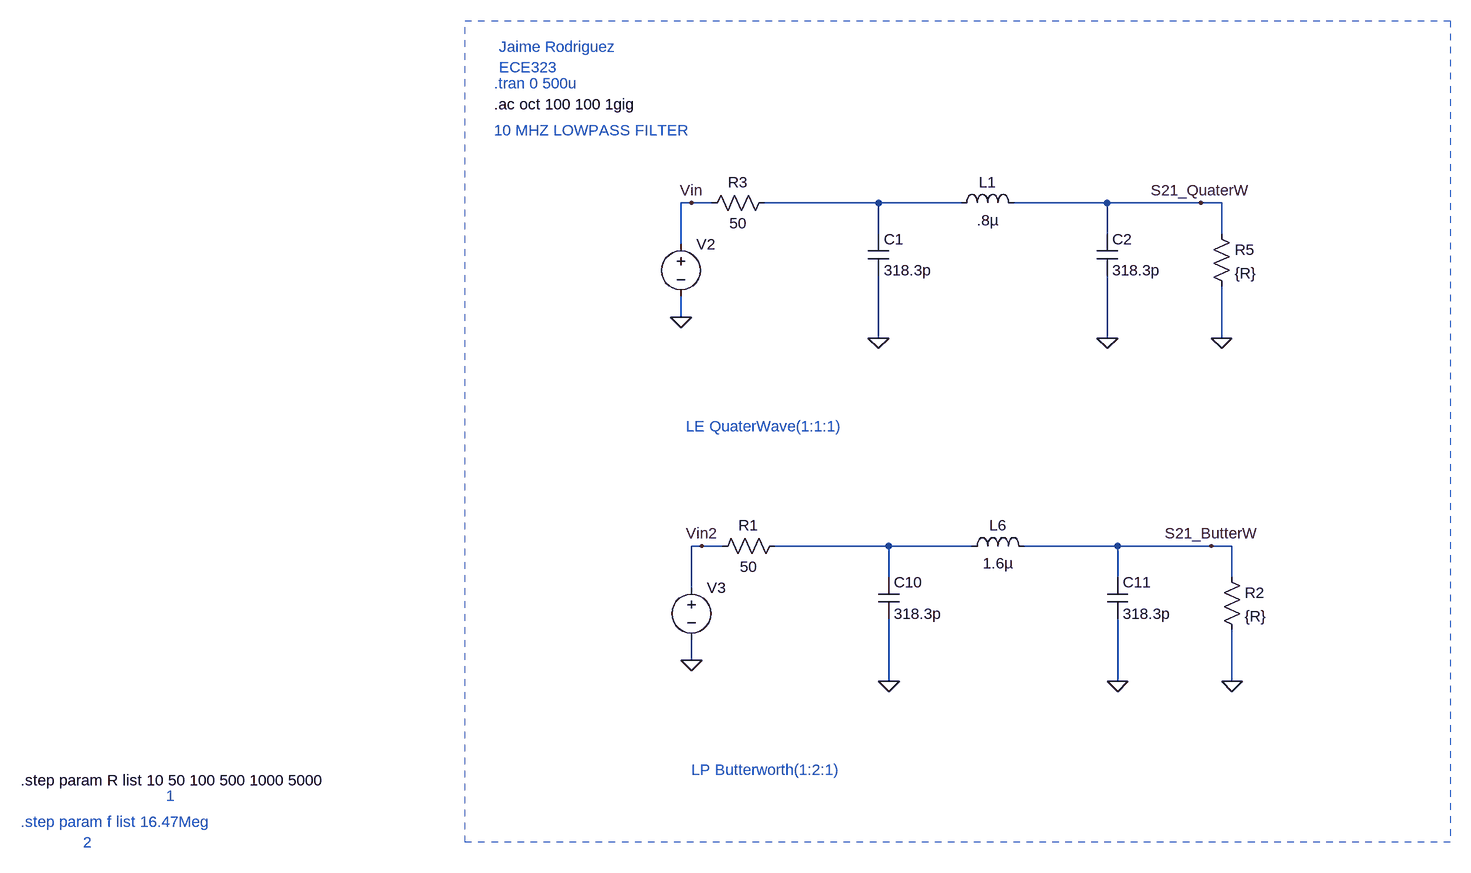
[diagram p0: schematic Lowpass.asc]
Lowpass.asc, the LTspice schematic file:
Version 4
SHEET 1 1652 704
WIRE 480 -1072 464 -1072
WIRE 512 -1072 480 -1072
WIRE 768 -1072 592 -1072
WIRE 896 -1072 768 -1072
WIRE 1120 -1072 976 -1072
WIRE 1264 -1072 1120 -1072
WIRE 1296 -1072 1264 -1072
WIRE 768 -1024 768 -1072
WIRE 1120 -1024 1120 -1072
WIRE 1296 -1024 1296 -1072
WIRE 464 -1008 464 -1072
WIRE 464 -896 464 -928
WIRE 768 -864 768 -960
WIRE 1120 -864 1120 -960
WIRE 1296 -864 1296 -944
WIRE 496 -544 480 -544
WIRE 528 -544 496 -544
WIRE 784 -544 608 -544
WIRE 912 -544 784 -544
WIRE 1136 -544 992 -544
WIRE 1280 -544 1136 -544
WIRE 1312 -544 1280 -544
WIRE 784 -496 784 -544
WIRE 1136 -496 1136 -544
WIRE 1312 -496 1312 -544
WIRE 480 -480 480 -544
WIRE 480 -368 480 -400
WIRE 784 -336 784 -432
WIRE 1136 -336 1136 -432
WIRE 1312 -336 1312 -416
FLAG 784 -336 0
FLAG 1136 -336 0
FLAG 480 -368 0
FLAG 1312 -336 0
FLAG 768 -864 0
FLAG 1120 -864 0
FLAG 464 -896 0
FLAG 1296 -864 0
FLAG 1264 -1072 S21_QuaterW
FLAG 1280 -544 S21_ButterW
FLAG 480 -1072 Vin
FLAG 496 -544 Vin2
SYMBOL cap 768 -496 R0
SYMATTR InstName C10
SYMATTR Value 318.3p
SYMBOL cap 1120 -496 R0
SYMATTR InstName C11
SYMATTR Value 318.3p
SYMBOL ind 896 -528 R270
WINDOW 0 32 56 VTop 2
WINDOW 3 5 56 VBottom 2
SYMATTR InstName L6
SYMATTR Value 1.6µ
SYMBOL voltage 480 -496 R0
WINDOW 3 24 96 Invisible 2
WINDOW 39 0 0 Left 2
SYMATTR Value SINE(0 1 6.8Meg)
SYMATTR InstName V3
SYMATTR Value2 AC 2
SYMBOL res 624 -560 R90
WINDOW 0 0 56 VBottom 2
WINDOW 3 32 56 VTop 2
SYMATTR InstName R1
SYMATTR Value 50
SYMBOL res 1296 -512 R0
SYMATTR InstName R2
SYMATTR Value {R}
SYMBOL cap 752 -1024 R0
SYMATTR InstName C1
SYMATTR Value 318.3p
SYMBOL cap 1104 -1024 R0
SYMATTR InstName C2
SYMATTR Value 318.3p
SYMBOL ind 880 -1056 R270
WINDOW 0 32 56 VTop 2
WINDOW 3 5 56 VBottom 2
SYMATTR InstName L1
SYMATTR Value .8µ
SYMBOL voltage 464 -1024 R0
WINDOW 3 24 96 Invisible 2
WINDOW 39 0 0 Left 2
SYMATTR Value SINE(0 2 16.57Meg)
SYMATTR InstName V2
SYMATTR Value2 AC 2
SYMBOL res 608 -1088 R90
WINDOW 0 0 56 VBottom 2
WINDOW 3 32 56 VTop 2
SYMATTR InstName R3
SYMATTR Value 50
SYMBOL res 1280 -1040 R0
SYMATTR InstName R5
SYMATTR Value {R}
TEXT 176 -1224 Left 2 !.ac oct 100 100 1gig
TEXT 176 -1184 Left 2 ;10 MHZ LOWPASS FILTER
TEXT 472 -728 Left 2 ;LE QuaterWave(1:1:1)
TEXT 480 -200 Left 2 ;LP Butterworth(1:2:1)
TEXT 176 -1256 Left 2 ;.tran 0 500u
TEXT -552 -120 Left 2 ;.step param f list 16.47Meg
TEXT -456 -88 Left 2 ;2
TEXT -552 -184 Left 2 !.step param R list 10 50 100 500 1000 5000
TEXT -328 -160 Left 2 ;1
TEXT 184 -1312 Left 2 ;Jaime Rodriguez\nECE323
RECTANGLE Normal 132 -1352 1648 -88 2

The netlist it stands for:
* Lowpass.asc
C10 N002 0 318.3p
C11 S21_ButterW 0 318.3p
L6 N002 S21_ButterW 1.6µ
V3 Vin2 0 SINE(0 1 6.8Meg) AC 2
R1 N002 Vin2 50
R2 S21_ButterW 0 {R}
C1 N001 0 318.3p
C2 S21_QuaterW 0 318.3p
L1 N001 S21_QuaterW .8µ
V2 Vin 0 SINE(0 2 16.57Meg) AC 2
R3 N001 Vin 50
R5 S21_QuaterW 0 {R}
.ac oct 100 100 1gig
* 10 MHZ LOWPASS FILTER
* LE QuaterWave(1:1:1)
* LP Butterworth(1:2:1)
* .tran 0 500u
* .step param f list 16.47Meg
* 2
.step param R list 10 50 100 500 1000 5000
* 1
* Jaime Rodriguez
* ECE323
.backanno
.end